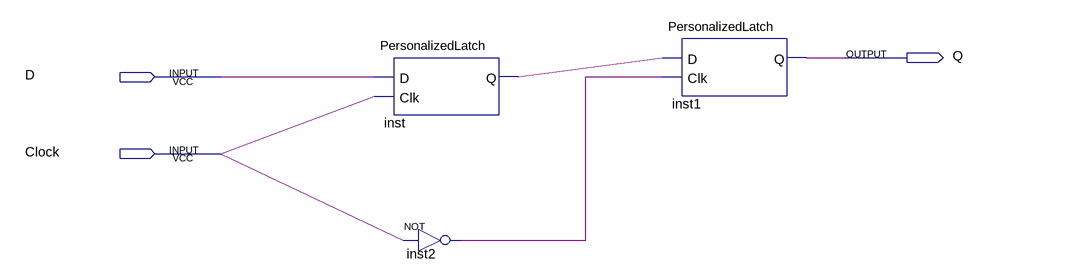
[diagram p0: schematic sheet]
// Quartus schematic NegativeEdgeFlipFlop.bdf as structural Verilog: 3 symbols, 3 pins
module NegativeEdgeFlipFlop (
  input  D,
  input  Clock,
  output Q
);

  wire inst2_out, inst_q;

  PersonalizedLatch inst (.D(D), .Clk(Clock), .Q(inst_q));
  not inst2 (inst2_out, Clock);
  PersonalizedLatch inst1 (.D(inst_q), .Clk(inst2_out), .Q(Q));
endmodule
